# Altium schematic sheet pkob.SchDoc
size A4
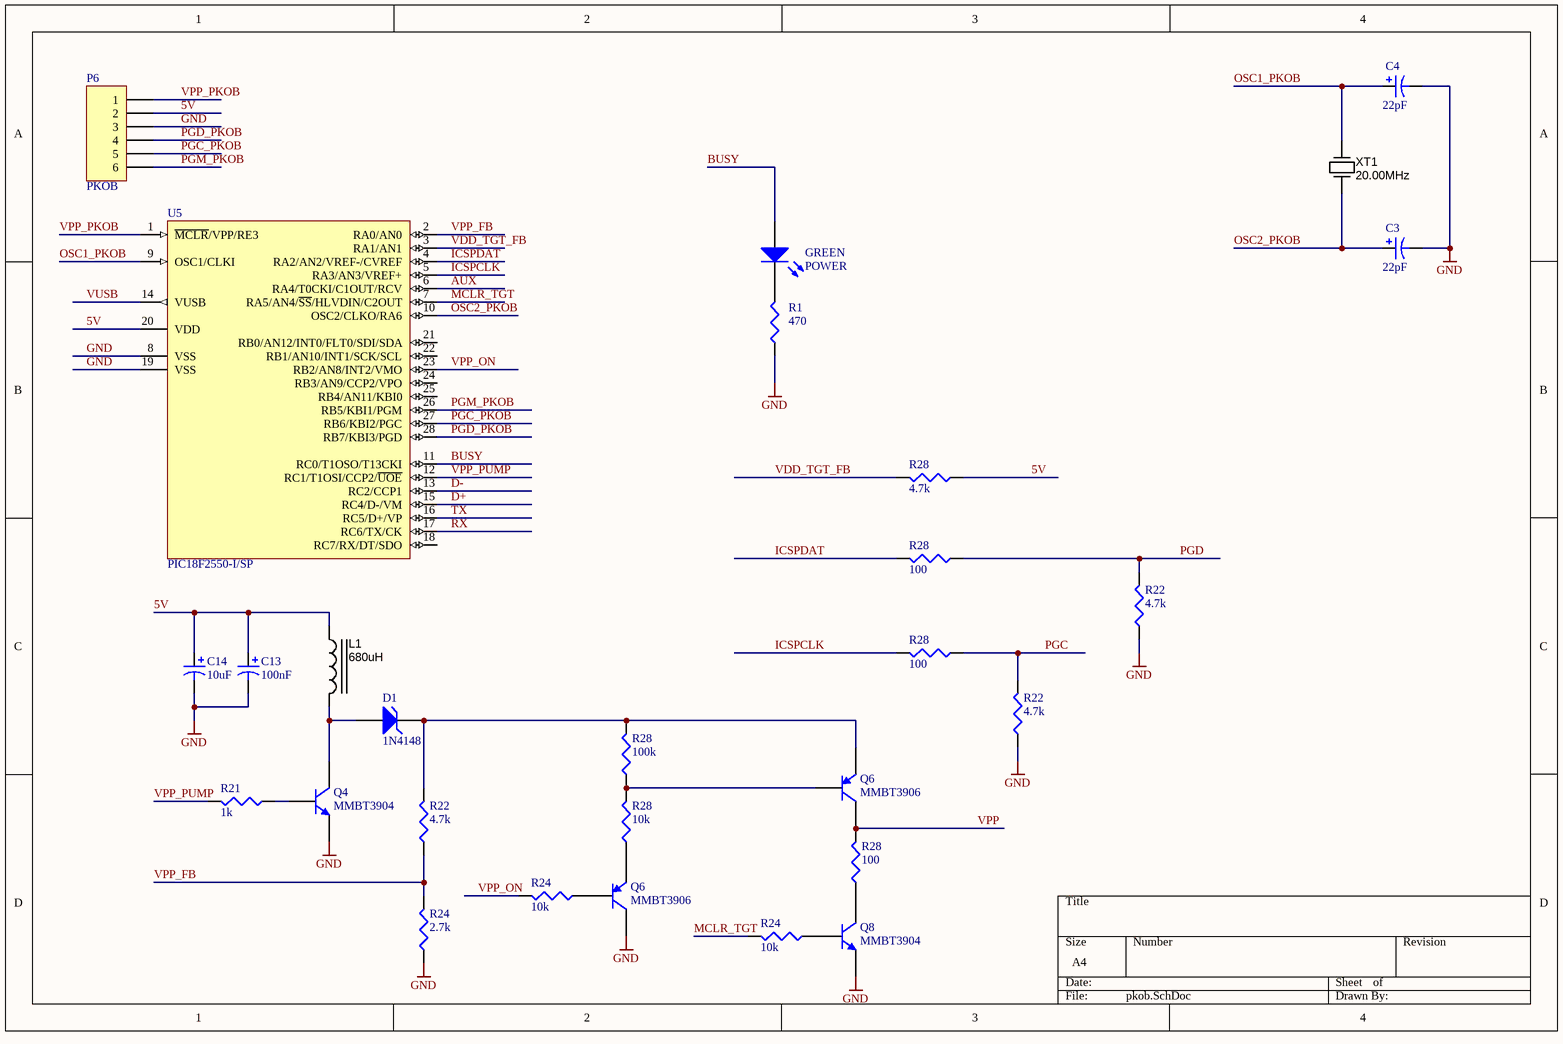
[diagram p0: pkob.SchDoc]

## Parts
(Parts that share a designator on the sheet are numbered #1, #2 ... from top to bottom, then left to right.)
C3  value 22pF  [C0805]  (hidden comment: Cap Pol3)
C4  value 22pF  [C0805]  (hidden comment: Cap Pol3)
C13  value 100nF  [C0805]  (hidden comment: Cap Pol3)
C14  value 10uF  [C0805]  (hidden comment: Cap Pol3)
D1  1N4148  [SOD-123]
GREEN  POWER  [3.5X2.8X1.9]
L1  680uH  [IND_WW_DR73]
P6  PKOB  [HDR1X6]
Q4  MMBT3904  [SOT23_N]
Q6#1  MMBT3906  [SOT23_N]
Q6#2  MMBT3906  [SOT23_N]
Q8  MMBT3904  [SOT23_N]
R1  value 470  [RESC2012X70N]  (hidden comment: Res3)
R21  value 1k  [RESC2012X70N]  (hidden comment: Res3)
R22#1  value 4.7k  [RESC2012X70N]  (hidden comment: Res3)
R22#2  value 4.7k  [RESC2012X70N]  (hidden comment: Res3)
R22#3  value 4.7k  [RESC2012X70N]  (hidden comment: Res3)
R24#1  value 10k  [RESC2012X70N]  (hidden comment: Res3)
R24#2  value 2.7k  [RESC2012X70N]  (hidden comment: Res3)
R24#3  value 10k  [RESC2012X70N]  (hidden comment: Res3)
R28#1  value 4.7k  [RESC2012X70N]  (hidden comment: Res3)
R28#2  value 100  [RESC2012X70N]  (hidden comment: Res3)
R28#3  value 100  [RESC2012X70N]  (hidden comment: Res3)
R28#4  value 100k  [RESC2012X70N]  (hidden comment: Res3)
R28#5  value 10k  [RESC2012X70N]  (hidden comment: Res3)
R28#6  value 100  [RESC2012X70N]  (hidden comment: Res3)
U5  PIC18F2550-I/SP  [SPDIP300-SP28]
XT1  20.00MHz  [CRYSTAL_HC49-US-SM]

## Nets
GND: C3.2 C4.2 C13.2 C14.2 P6.3 Q4.2(E) Q6#2.3(C) Q8.2(E) R1.1 R22#1.1 R22#2.1 R24#2.1 U5.8(VSS) U5.19(VSS)
5V: C13.1 C14.1 L1.1 P6.2 R28#1.1 U5.20(VDD)
AUX: U5.6(RA4/T0CKI/C1OUT/RCV)
BUSY: GREEN.1(A) U5.11(RC0/T1OSO/T13CKI)
D+: U5.15(RC4/D-/VM)
D-: U5.13(RC2/CCP1)
ICSPCLK: R28#3.2 U5.5(RA3/AN3/VREF+)
ICSPDAT: R28#2.2 U5.4(RA2/AN2/VREF-/CVREF)
MCLR_TGT: R24#3.2 U5.7(RA5/AN4/~{SS}/HLVDIN/C2OUT)
OSC1_PKOB: C4.1 U5.9(OSC1/CLKI) XT1.2(OUT)
OSC2_PKOB: C3.1 U5.10(OSC2/CLKO/RA6) XT1.1(IN)
PGC: R22#2.2 R28#3.1
PGC_PKOB: P6.5 U5.27(RB6/KBI2/PGC)
PGD: R22#1.2 R28#2.1
PGD_PKOB: P6.4 U5.28(RB7/KBI3/PGD)
PGM_PKOB: P6.6 U5.26(RB5/KBI1/PGM)
RX: U5.17(RC6/TX/CK)
TX: U5.16(RC5/D+/VP)
VDD_TGT_FB: R28#1.2 U5.3(RA1/AN1)
VPP: Q6#1.3(C) R28#6.2
VPP_FB: R22#3.1 R24#2.2 U5.2(RA0/AN0)
VPP_ON: R24#1.2 U5.23(RB2/AN8/INT2/VMO)
VPP_PKOB: P6.1 U5.1(~{MCLR}/VPP/RE3)
VPP_PUMP: R21.2 U5.12(RC1/T1OSI/CCP2/~{UOE})
VUSB: U5.14(VUSB)
NetD1_1: D1.1(A) L1.2 Q4.3(C)
NetD1_2: D1.2(K) Q6#1.2(E) R22#3.2 R28#4.2
NetGREEN_2: GREEN.2(K) R1.2
NetQ4_1: Q4.1(B) R21.1
NetQ6#1_1: Q6#1.1(B) R28#4.1 R28#5.2
NetQ6#2_1: Q6#2.1(B) R24#1.1
NetQ6#2_2: Q6#2.2(E) R28#5.1
NetQ8_1: Q8.1(B) R24#3.1
NetQ8_3: Q8.3(C) R28#6.1

Not connected (* = marked no-connect by the designer): U5 18(RC7/RX/DT/SDO) 21(RB0/AN12/INT0/FLT0/SDI/SDA) 22(RB1/AN10/INT1/SCK/SCL) 24(RB3/AN9/CCP2/VPO) 25(RB4/AN11/KBI0)

## Library data of the parts
C3 C4 C13 C14 = Cap Pol3: Polarized Capacitor (Surface Mount); Published: 8-Jun-2000; LatestRevisionDate: 29-May-2009; LatestRevisionNote: IPC-7351 Footprint Added.; PackageReference: C0805; Publisher: Altium Limited; PackageDescription: Chip Capacitor
  C3 C4: Supplier Part Number 1: *
D1 = BZT52C47: Surface Mount Zener Diode; Published: 8-Jun-2000; LatestRevisionDate: 17-Jul-2002; LatestRevisionNote: Re-released for DXP Platform.; DatasheetDocument: REV. L-2; PackageReference: SOD-123; Publisher: Altium Limited; ComponentLink1Description: Manufacturer Link; ComponentLink1URL: http://www.vishay.com/; Supplier Part Number 1: 1N4148W-E3-18CT-ND; Supplier 1: Digi-Key
GREEN = LED3: Typical BLUE SiC LED; Published: 8-Jun-2000; LatestRevisionDate: 17-Dec-2003; LatestRevisionNote: PCB Footprint replaced.; DatasheetVersion: 16-Apr-2002; PackageVersion: 16-Apr-2002; PackageReference: 3.5X2.8X1.9; Publisher: Altium Limited; PackageDescription: SM LED; 2 C-Bend Leads; Body 3.5 x 2.8 x 1.9 mm, inc leads (LxWxH typ); Supplier Part Number 1: 732-4997-1-ND; Supplier 1: Digi-Key
L1 = INDC_10u_DR73-100-R: Inductor Power 10µH 2.1A 7.6x7.6mm SMD; Manufacturer 1: Cooper Bussmann; Tolerance: ±20%; Material: ferrite shielded; SCDType: spec; Package / Case: 5.0x5.0x4.5mm; Ratings: 2.1 A; Supplier 1: Digi-Key; Supplier Part Number 1: 513-1129-1-ND; Manufacturer Part Number 1: DR73-100-R; ComponentLink1URL: http://www.cooperindustries.com/content/dam/public/bussmann/Electronics/Resources/Data%20Sheets/Bus_Elx_DS_4315_DR_Series.pdf; ComponentLink1Description: http://www.cooperindustries.com/content/dam/public/bussmann/Electronics/Resources/Data%20Sheets/Bus_Elx_DS_4315_DR_Series.pdf; Value: 680uH
P6 = Header 6: Header, 6-Pin; LatestRevisionDate: 17-Jul-2002; LatestRevisionNote: Re-released for DXP Platform.; Publisher: Altium Limited
Q4 Q8 = MMBT3904: NPN Switching Transistor; Published: 17-Sep-2003; LatestRevisionDate: 12-Dec-2006; LatestRevisionNote: IPC-7351 Footprint Added.; DatasheetVersion: 13-May-2002; PackageVersion: May-1999; PackageReference: SOT23; Publisher: Altium Limited; PackageDescription: 3-Pin SOT-23 Package 0.95 mm Pitch, 2.3 mm Lead Span; ComponentLink1Description: Manufacturer Link; ComponentLink1URL: http://www.semiconductors.philips.com/; ComponentLink2Description: Datasheet; ComponentLink2URL: http://www.semiconductors.philips.com/acrobat/datasheets/MMBT3904_4.pdf; Supplier Part Number 1: MMBT3904FSCT-ND; Supplier 1: Digi-Key
Q6#1 Q6#2 = MMBT3906: PNP Switching Transistor; Published: 17-Sep-2003; LatestRevisionDate: 12-Dec-2006; LatestRevisionNote: IPC-7351 Footprint Added.; DatasheetVersion: 11-Apr-2000; PackageVersion: May-1999; PackageReference: SOT23; Publisher: Altium Limited; PackageDescription: 3-Pin SOT-23 Package 0.95 mm Pitch, 2.3 mm Lead Span; ComponentLink1Description: Manufacturer Link; ComponentLink1URL: http://www.semiconductors.philips.com/; ComponentLink2Description: Datasheet; ComponentLink2URL: http://www.semiconductors.philips.com/acrobat/datasheets/MMBT3906_2.pdf; Supplier Part Number 1: MMBT3906LT1GOSCT-ND
R1 R21 R22#1-R22#3 R24#1-R24#3 R28#1-R28#6 = Res3: Resistor; Published: 8-Jun-2000; LatestRevisionDate: 29-May-2009; LatestRevisionNote: IPC-7351 Footprint Added.; PackageReference: J1-0603; Publisher: Altium Limited; PackageDescription: Chip Resistor
  R1: Supplier Part Number 1: *
U5 = PIC18F2550-I/SP: High Performance, Enhanced Flash, USB Microcontroller with nanoWatt Technology, 32K Flash, 28-Pin SPDIP, Industrial Temperature Range; Published: 29-Jan-2009; LatestRevisionDate: 02-Dec-2009; LatestRevisionNote: Updated to datasheet revision E, Aug-2008; DatasheetVersion: revE, Aug-2008; PackageVersion: revBB, Aug-2009; PackageReference: SPDIP300-SP28; Publisher: Altium Limited; PackageDescription: 28-Lead Skinny Plastic Dual In-Line (SP) - 300 mil Body [SPDIP]; Supplier 1: Digi-Key; Supplier Part Number 1: PIC18F2550-I/SP-ND; Supplier 2: Farnell; Supplier Part Number 2: 9321250; Supplier 3: Farnell; Supplier Part Number 3: 1523822; ComponentLink1Description: Datasheet; ComponentLink1URL: http://ww1.microchip.com/downloads/en/DeviceDoc/39632e.pdf; ComponentLink2Description: Packaging Specification; ComponentLink2URL: http://www.microchip.com/stellent/groups/techpub_sg/documents/packagingspec/en012702.pdf; ComponentLink3Description: Microchip.com Home; ComponentLink3URL: http://www.microchip.com/
XT1 = Crystal_6MHz_HC49/US: Resonator Ceramic 20.00 MHz 30ppm; Manufacturer 1: CTS-Frequency Controls; Manufacturer Part Number 1: ATS060BSM-1; Frequency: 20MHz; Frequency Stability: ±50ppm; Load Capacitance: 18pF; Operating Mode: Fundamental; Parameter Name: 0.169" (4.30mm); SCDType: spec; Package / Case: HC49/US-SM; Ratings: 20.00 MHz; Supplier 1: Digi-Key; Supplier Part Number 1: XC1254CT-ND; Type: MHz Crystal; Frequency Tolerance: ±30ppm; Operating Temperature: -20°C ~ 70°C; Mounting Type: Surface Mount; Size / Dimension: 0.437" L x 0.190" W (11.10mm x 4.83mm); ComponentLink1URL: http://www.ctscorp.com/components/Datasheets/008-0309-0.pdf; ComponentLink1Description: http://www.ctscorp.com/components/Datasheets/008-0309-0.pdf